# Altium schematic sheet TCA785-U.SchDoc
size A; SheetNumber: 1; SheetTotal: 4
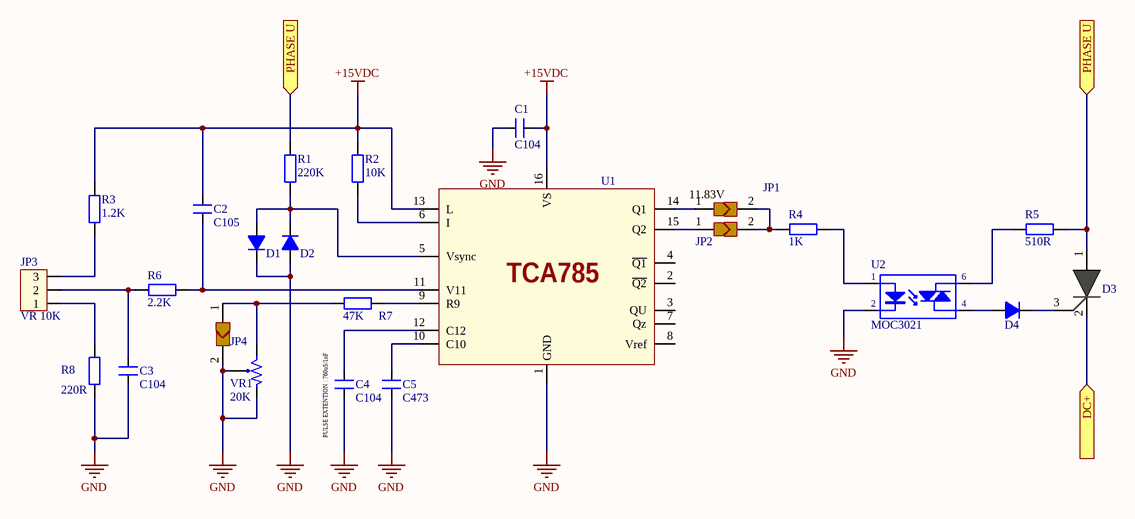
[diagram p0: TCA785-U.SchDoc]

## Parts
C1  C104  [CN2-O]
C2  C105  [CN2-O]
C3  C104  [CN2-O]
C4  C104  [CN2-O]
C5  C473  [CN2-O]
D1  Diode  1N4007  [DO41-1A]  (value not drawn)
D2  Diode  1N4007  [DO41-1A]  (value not drawn)
D3  SCR  [TO-220]  (value not drawn)
D4  Diode  1N4007  [DO41-1A]  (value not drawn)
JP1  PAD_Sellect  [PAD Select]  (value not drawn)
JP2  PAD_Sellect  [PAD Select]  (value not drawn)
JP3  VR 10K  [CON3]
JP4  PAD_Sellect  [PAD Select]  (value not drawn)
R1  220K  [R1/4W]
R2  10K  [R1/4W]
R3  1.2K  [R1/4W]
R4  1K  [R1/4W]
R5  510R  [R1/4W]
R6  2.2K  [R1/4W]
R7  47K  [R1/4W]
R8  220R  [R1/4W]
U1  TCA785Q  [DIP-16]  (value not drawn)
U2  MOC3021  [DIP6/W0.3 - MOC3021]
VR1  20K  [VR]

## Ports
DC+ (in), PHASE U (in)

## Nets
+15VDC: C1.2 C2.2 R2.1 R3.2 U1.13(L) U1.16(VS)
GND: C1.1 C3.1 C4.1 C5.1 D1.2 D2.1 JP4.2 R8.1 U1.1(GND) U2.2(K) VR1.1 VR1.2
DC+: D3.2(K) ; port DC+
PHASE U: D3.1(A) R1.1 R5.1 ; port PHASE U
NetC2_1: C2.1 R6.1 U1.11(V11)
NetC3_2: C3.2 JP3.2 R6.2
NetC4_2: C4.2 U1.12(C12)
NetC5_2: C5.2 U1.10(C10)
NetD1_1: D1.1 D2.2 R1.2 U1.5(Vsync)
NetD3_3: D3.3(G) D4.2
NetD4_1: D4.1 U2.4(E)
NetJP1_1: JP1.1 U1.14(Q1)
NetJP1_2: JP1.2 JP2.2 R4.2
NetJP2_1: JP2.1 U1.15(Q2)
NetJP3_1: JP3.1 R8.2
NetJP3_3: JP3.3 R3.1
NetJP4_1: JP4.1 R7.1 VR1.3
NetR2_2: R2.2 U1.6(I)
NetR4_1: R4.1 U2.1(A)
NetR5_2: R5.2 U2.6(C)
NetR7_2: R7.2 U1.9(R9)

Not connected (* = marked no-connect by the designer): U1 2(~{Q2}) 3(QU) 4(~{Q1}) 7(Qz) 8(Vref)

## Notes on the sheet
- (near JP1) 11.83V
- (near C4) PULSE EXTENTION : 760uS/1nF
- (in symbol TCA785Q) TCA785

## Library data of the parts
C1-C5 = CAP-gom: Value: 33pF
D1 D2 D4 = Diode  1N4007: Diode 1A; Value: 1N4007
D3 = BT151
JP3 = Con3: Connector 3; Value: Connector 3
R1-R8 = R1/4W: Resistor 1/4W; Value: R1/4W - 1K
U2 = MOC3021: Single Opto; Value: MOC3021
VR1 = VR: Var Resistor RM065; RM065-104: 10K; RM065-503: 5K; RM065-103: 1K